# Altium schematic sheet Power_Supply.SchDoc
size A4
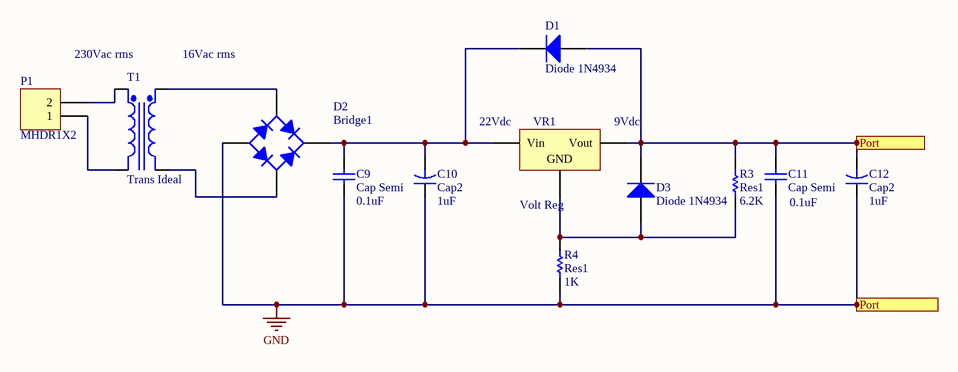
[diagram p0: Power_Supply.SchDoc]

## Parts
C9  Cap Semi  value 0.1uF  [C1206]
C10  Cap2  value 1uF  [CAPR5-4X5]
C11  Cap Semi  value 0.1uF  [C1206]
C12  Cap2  value 1uF  [CAPR5-4X5]
D1  Diode 1N4934  [DO-41]
D2  Bridge1  [D-38]
D3  Diode 1N4934  [DO-41]
P1  MHDR1X2  [MHDR1X2]
R3  Res1  value 6.2K  [AXIAL-0.3]
R4  Res1  value 1K  [AXIAL-0.3]
T1  Trans Ideal  [TRF_4]
VR1  Volt Reg  [D2PAK_N]

## Ports
Port

## Nets
GND: C9.1 C10.1 C11.1 C11.2 C12.1 C12.2 D1.1(A) D2.3(A) D3.2(K) R3.1 R4.1 VR1.3(Vout) ; port Port
NetC9_2: C9.2 C10.2 D1.2(K) D2.1(K) VR1.1(Vin)
NetD2_2: D2.2(C) T1.4(Sec-)
NetD2_4: D2.4(C) T1.3(Sec+)
NetD3_1: D3.1(A) R3.2 R4.2 VR1.2(GND)
NetP1_1: P1.1 T1.2(Pri-)
NetP1_2: P1.2 T1.1(Pri+)

## Notes on the sheet
- 230Vac rms
- 16Vac rms
- (near VR1) 22Vdc
- (near VR1) 9Vdc

## Library data of the parts
C9 C11 = Cap Semi: Capacitor (Semiconductor SIM Model); Published: 8-Jun-2000; LatestRevisionDate: 29-May-2009; LatestRevisionNote: IPC-7351 Footprint Added.; PackageReference: C1206; Publisher: Altium Limited; PackageDescription: Chip Capacitor
C10 C12 = Cap2: Capacitor; Published: 23-Sep-2002; PackageReference: CAPR5-4X5; Publisher: Altium Limited; PackageDescription: Capacitor; 2 Leads
D1 D3 = Diode 1N4934: 1 Amp Fast Recovery Rectifier; Published: 8-Jun-2000; LatestRevisionDate: 17-Jul-2002; LatestRevisionNote: Re-released for DXP Platform.; DatasheetVersion: 1999; PackageVersion: Aug-1999; PackageReference: DO-41; Publisher: Altium Limited; PackageDescription: Diode, Axial; Body 5.2 x 2.7 mm (LxDia. max), Lead Dia. 0.86 mm (max); Code_JEDEC: DO-204-AL; ComponentLink1Description: Manufacturer Link; ComponentLink1URL: http://www.fairchildsemi.com/; ComponentLink2Description: Datasheet; ComponentLink2URL: http://www.fairchildsemi.com/ds/1N%2F1N4934.pdf
D2 = Bridge1: Full Wave Diode Bridge; Published: 8-Jun-2000; LatestRevisionDate: 29-May-2009; LatestRevisionNote: Sch pins A & K swapped.; DatasheetVersion: E2732B; PackageReference: D-38; Publisher: Altium Limited; PackageDescription: Bridge Rectifier; 4 Terminals; Body 9.4 x 9.4 mm (typ); Pitch 5.08 mm
P1 = MHDR1X2: Header, 2-Pin; LatestRevisionDate: 17-Jul-2002; LatestRevisionNote: Re-released for DXP Platform.; Publisher: Altium Limited
R3 R4 = Res1: Resistor; Published: 8-Jun-2000; LatestRevisionDate: 17-Jul-2002; LatestRevisionNote: Re-released for DXP Platform.; PackageReference: AXIAL-0.3; Publisher: Altium Limited; PackageDescription: Axial Device, Thru-Hole; 2 Leads; 0.3 in Pin Spacing
T1 = Trans Ideal: Transformer (Ideal); Published: 8-Jun-2000; LatestRevisionDate: 17-Jul-2002; LatestRevisionNote: Re-released for DXP Platform.; PackageReference: TRF_4; Publisher: Altium Limited; PackageDescription: Transformer; 4 Leads
VR1 = Volt Reg: Voltage Regulator; Published: 24-Mar-1999; LatestRevisionDate: 29-May-2009; LatestRevisionNote: IPC-7351 Footprint Added.; PackageReference: D2PAK; Publisher: Altium Limited; PackageDescription: 3-Pin Transistor Outline Package 2.54 mm Pitch, 15.1 mm Lead Span